# Altium schematic sheet IMU.SchDoc
size A; SheetNumber: 3; SheetTotal: 6
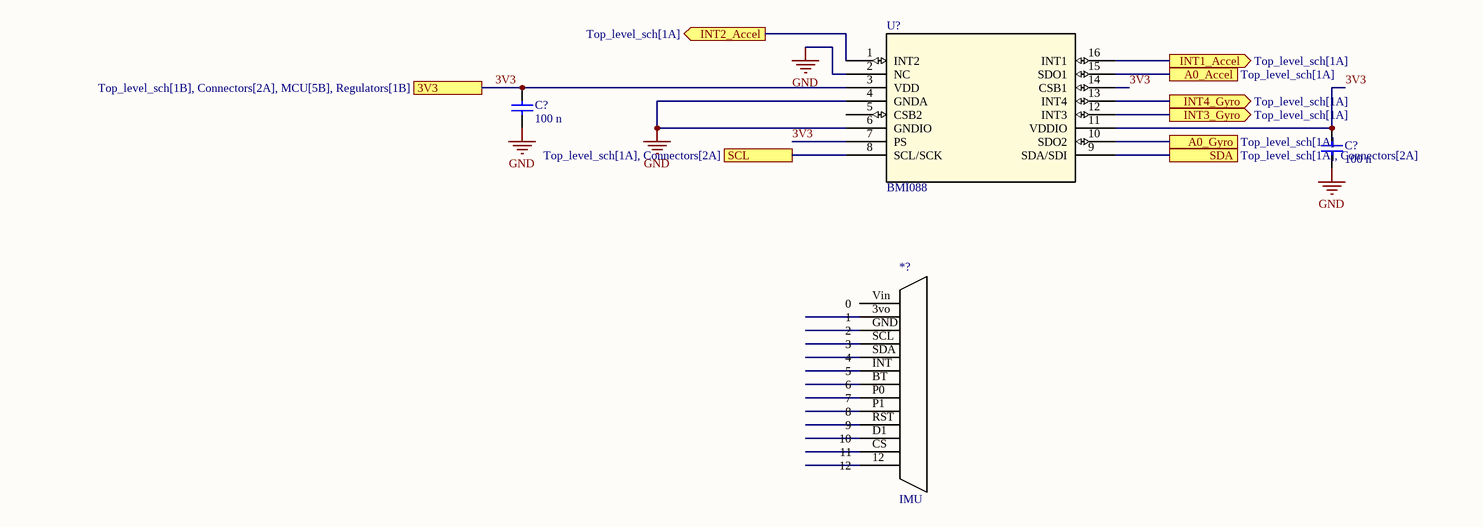
[diagram p0: IMU.SchDoc]

## Parts
(Parts that share a designator on the sheet are numbered #1, #2 ... from top to bottom, then left to right.)
*?  IMU
C?#1  value 100 n  (hidden comment: Capacitor)
C?#2  value 100 n  (hidden comment: Capacitor)
U?  BMI088  [QFN_BMI085_BOS]

## Ports
3V3 (see Top_level_sch[1B], Connectors[2A], MCU[5B], Regulators[1B]), A0_Accel (see Top_level_sch[1A]), A0_Gyro (see Top_level_sch[1A]), INT1_Accel (out, see Top_level_sch[1A]), INT2_Accel (out, see Top_level_sch[1A]), INT3_Gyro (out, see Top_level_sch[1A]), INT4_Gyro (out, see Top_level_sch[1A]), SCL (see Top_level_sch[1A], Connectors[2A]), SDA (see Top_level_sch[1A], Connectors[2A])

## Nets
GND: C?#1.2 C?#2.2 U?.2(NC) U?.4(GNDA) U?.6(GNDIO)
3V3: C?#1.1 C?#2.1 U?.3(VDD) U?.7(PS) U?.11(VDDIO) U?.14(CSB1) ; port 3V3
A0_Accel: U?.15(SDO1) ; port A0_Accel
A0_Gyro: U?.10(SDO2) ; port A0_Gyro
INT1_Accel: U?.16(INT1) ; port INT1_Accel
INT2_Accel: U?.1(INT2) ; port INT2_Accel
INT3_Gyro: U?.12(INT3) ; port INT3_Gyro
INT4_Gyro: U?.13(INT4) ; port INT4_Gyro
SCL: U?.8(SCL/SCK) ; port SCL
SDA: U?.9(SDA/SDI) ; port SDA

Not connected (* = marked no-connect by the designer): *? 3vo(1) 12 BT(6) CS(11) D1(10) GND(2) INT(5) P0(7) P1(8) RST(9) SCL(3) SDA(4) Vin(0); U? 5(CSB2)

## Library data of the parts
C?#1 C?#2 = Capacitor: SimulationGenericComponent: True
U? = BMI088: No Description Available; Mfr_Name: Bosch Sensortec; Copyright: Copyright (C) 2022 Ultra Librarian. All rights reserved.; Manufacturer_Part_Number: BMI088; RefDes: RefDes; Type: DEV